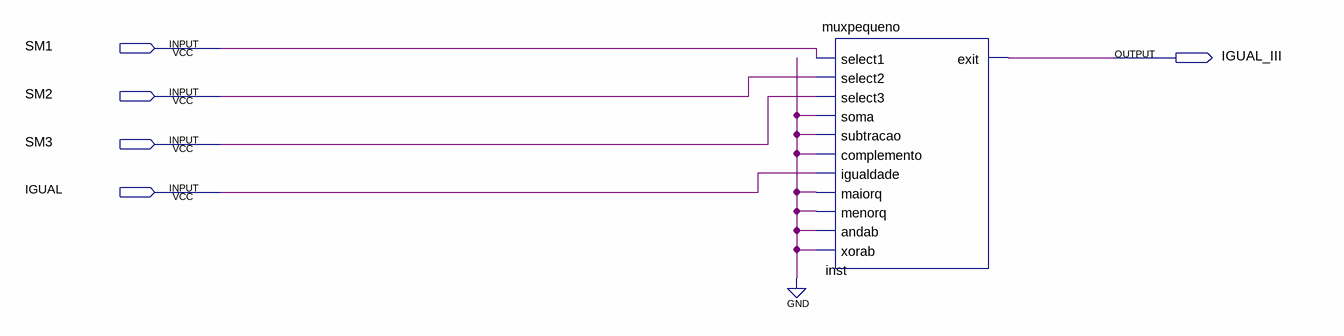
[diagram p0: schematic sheet]
// Quartus schematic IGUALDADE.bdf as structural Verilog: 1 symbols, 5 pins
module IGUALDADE (
  input  SM1,
  input  SM2,
  input  SM3,
  input  IGUAL,
  output IGUAL_III
);

  muxpequeno inst (
    .select1(SM1), .select2(SM2), .select3(SM3), .soma(1'b0), .subtracao(1'b0), .complemento(1'b0),
    .igualdade(IGUAL), .maiorq(1'b0), .menorq(1'b0), .andab(1'b0), .xorab(1'b0), .exit(IGUAL_III));
endmodule
